# EAGLE design Adafruit eInk Breakout Friend (EAGLE 9.2.0)
COMPANY: ADAFRUIT INDUSTRIES; DRAWN: K. TOWNSEND; REV: A
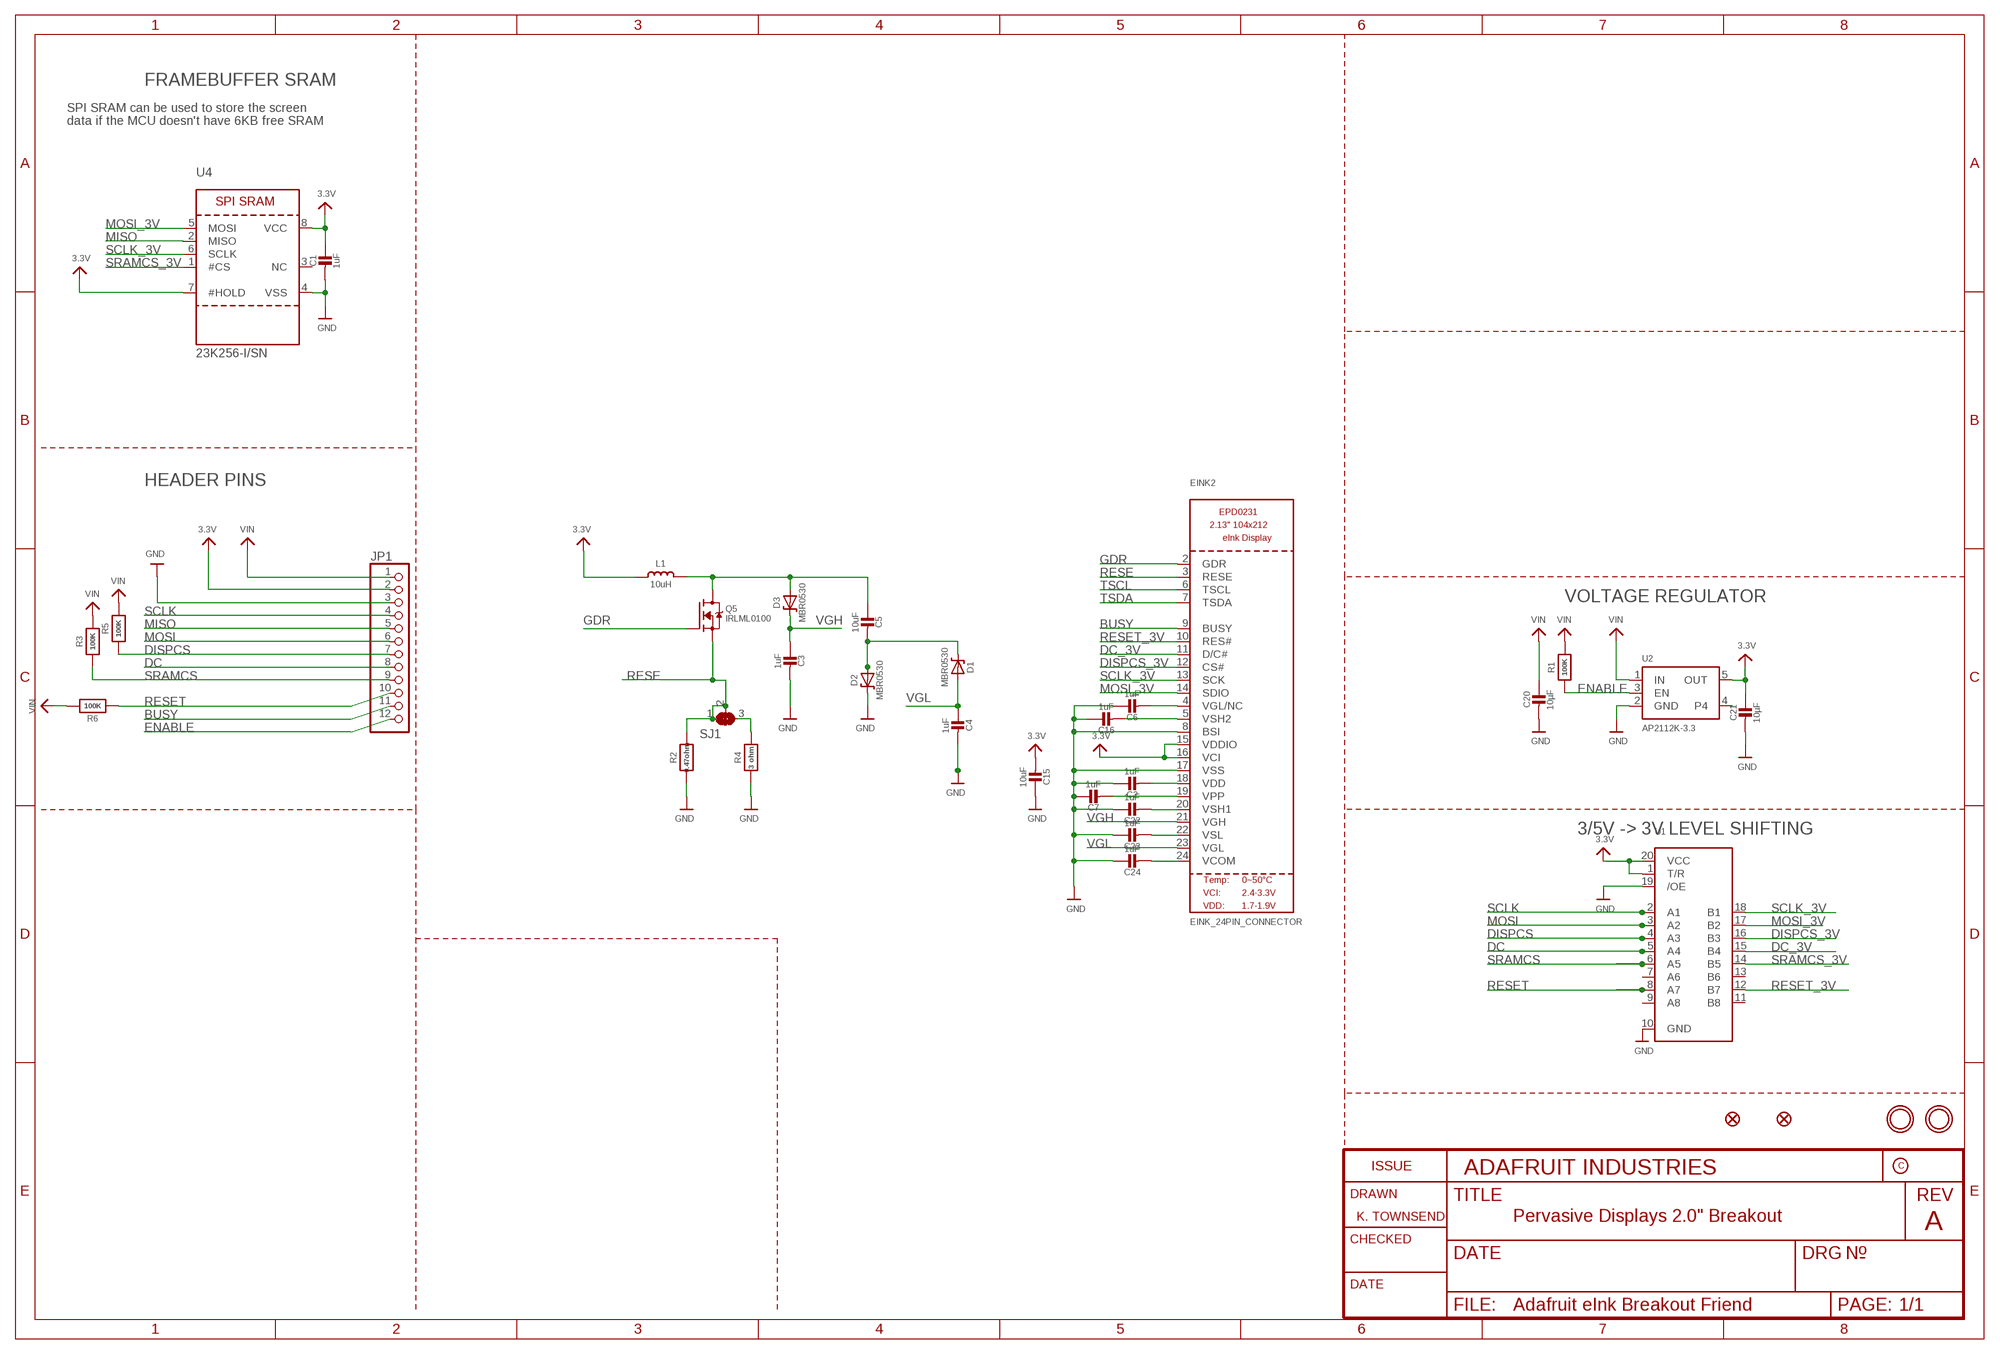
[diagram p0: schematic, sheet 1]

## Parts
C1  1uF  CAP_CERAMIC0805_10MGAP  [0805_10MGAP]
C2  1uF  CAP_CERAMIC0805-NOOUTLINE  [0805-NO]
C3  1uF  CAP_CERAMIC0805-NOOUTLINE  [0805-NO]
C4  1uF  CAP_CERAMIC0805-NOOUTLINE  [0805-NO]
C5  10uF  CAP_CERAMIC0805-NOOUTLINE  [0805-NO]
C6  1uF  CAP_CERAMIC0805-NOOUTLINE  [0805-NO]
C7  1uF  CAP_CERAMIC0805-NOOUTLINE  [0805-NO]
C15  10uF  CAP_CERAMIC0805-NOOUTLINE  [0805-NO]
C16  1uF  CAP_CERAMIC0805-NOOUTLINE  [0805-NO]
C20  10µF  CAP_CERAMIC0805-NOOUTLINE  [0805-NO]
C21  10µF  CAP_CERAMIC0805-NOOUTLINE  [0805-NO]
C22  1uF  CAP_CERAMIC0805-NOOUTLINE  [0805-NO]
C23  1uF  CAP_CERAMIC0805-NOOUTLINE  [0805-NO]
C24  1uF  CAP_CERAMIC0805-NOOUTLINE  [0805-NO]
D1  MBR0530  DIODE-SCHOTTKYSOD-123  [SOD-123]
D2  MBR0530  DIODE-SCHOTTKYSOD-123  [SOD-123]
D3  MBR0530  DIODE-SCHOTTKYSOD-123  [SOD-123]
EINK2  EINK_24PIN_CONNECTOR  [EINK_24PIN]
FID2  FIDUCIAL_1MM  [FIDUCIAL_1MM]
FID3  FIDUCIAL_1MM  [FIDUCIAL_1MM]
JP1  HEADER-1X1276MIL  [1X12_ROUND_76MIL]
L1  10uH  INDUCTORNR401  [INDUCTOR_4X4MM_NR401]
Q5  IRLML0100  IRLML2060TRPBF  [SOT23-3]
R1  100K  RESISTOR_0603_NOOUT  [0603-NO]
R2  0.47ohm  RESISTOR0805_NOOUTLINE  [0805-NO]
R3  100K  RESISTOR_0603_NOOUT  [0603-NO]
R4  3 ohm  RESISTOR0805_NOOUTLINE  [0805-NO]
R5  100K  RESISTOR_0603_NOOUT  [0603-NO]
R6  100K  RESISTOR_0603_NOOUT  [0603-NO]
SJ1  SOLDERJUMPER_2WAY  [SOLDERJUMPER_2WAY_OPEN_NOPASTE]
U1  74LCX245  [TSSOP20]
U2  AP2112K-3.3  VREG_SOT23-5  [SOT23-5]
U4  23K256-I/SN  SRAM_SPI_SOIC8  [SOIC8_150MIL]
U$3  MOUNTINGHOLE2.5  [MOUNTINGHOLE_2.5_PLATED]
U$4  MOUNTINGHOLE2.5  [MOUNTINGHOLE_2.5_PLATED]

## Nets
3.3V: C1.1 C15.2 C21.1 EINK2.15(VDDIO) EINK2.16(VCI) JP1.2 L1.P$2 U1.1(T/R) U1.20(VCC) U2.5(OUT) U4.7(#HOLD) U4.8(VCC)
BUSY: EINK2.9(BUSY) JP1.11
DC: JP1.8 U1.5(A4)
DC_3V: EINK2.11(D/C#) U1.15(B4)
DISPCS: JP1.7 R5.1 U1.4(A3)
DISPCS_3V: EINK2.12(CS#) U1.16(B3)
ENABLE: JP1.12 R1.1 U2.3(EN)
GDR: EINK2.2(GDR) Q5.1(G)
GND: C1.2 C2.1 C3.2 C4.2 C6.1 C7.1 C15.1 C16.1 C20.2 C21.2 C22.1 C23.1 C24.1 D2.C EINK2.8(BSI) EINK2.17(VSS) JP1.3 R2.2 R4.2 U1.10(GND) U1.19(/OE) U2.2(GND) U4.4(VSS)
MISO: JP1.5 U4.2(MISO)
MOSI: JP1.6 U1.3(A2)
MOSI_3V: EINK2.14(SDIO) U1.17(B2) U4.5(MOSI)
N$1: C7.2 EINK2.19(VPP)
N$2: C5.2 D1.C D2.A
N$3: C5.1 D3.A L1.P$1 Q5.3(D)
N$4: C16.2 EINK2.5(VSH2)
N$5: C2.2 EINK2.18(VDD)
N$6: C22.2 EINK2.20(VSH1)
N$8: R4.1 SJ1.3
N$9: C6.2 EINK2.4(VGL/NC)
N$27: C23.2 EINK2.22(VSL)
N$33: C24.2 EINK2.24(VCOM)
RESE: EINK2.3(RESE) Q5.2(S) R2.1 SJ1.1 SJ1.2
RESET: JP1.10 R6.1 U1.8(A7)
RESET_3V: EINK2.10(RES#) U1.12(B7)
SCLK: JP1.4 U1.2(A1)
SCLK_3V: EINK2.13(SCK) U1.18(B1) U4.6(SCLK)
SRAMCS: JP1.9 R3.1 U1.6(A5)
SRAMCS_3V: U1.14(B5) U4.1(#CS)
TSCL: EINK2.6(TSCL)
TSDA: EINK2.7(TSDA)
VGH: C3.1 D3.C EINK2.21(VGH)
VGL: C4.1 D1.A EINK2.23(VGL)
VIN: C20.1 JP1.1 R1.2 R3.2 R5.2 R6.2 U2.1(IN)
Unconnected: U1.7(A6) U1.9(A8) U1.11(B8) U1.13(B6) U2.4 U4.3(NC)

## Notes on the sheet
- FRAMEBUFFER SRAM
- SPI SRAM can be used to store the screen
- data if the MCU doesn't have 6KB free SRAM
- HEADER PINS
- VOLTAGE REGULATOR
- 3/5V -> 3V LEVEL SHIFTING
- Pervasive Displays 2.0" Breakout

## Library data of the parts
C1-C7 C15 C16 C20-C24 = microbuilder:CAP_CERAMIC: Ceramic Capacitors For new designs, use the packages preceded by an '_' character since they are more reliable: The following footprints should be used on most boards: _0402 - Standard footprint for regular board layouts _0603 - Standard footprint for regular board layouts _0805 - Standard footprint for regular board layouts _1206 - Standard footprint for regular board layouts For extremely tight-pitch boards where space is at a premium, the following 'micro-pitch' footprints can be used (smaller pads, no silkscreen outline, etc.): _0402MP - Micro-pitch footprint for very dense/compact boards _0603MP - Micro-pitch footprint for very dense/compact boards _0805MP - Micro-pitch footprint for very dense/compact boards _1206MP - Micro-pitch footprint for very dense/compact boards
D1-D3 = microbuilder:DIODE-SCHOTTKY
EINK2 = microbuilder:EINK_24PIN
FID2 FID3 = microbuilder:FIDUCIAL: Fiducial Alignment Points Various fiducial points for machine vision alignment.; BOM: EXCLUDE
JP1 = microbuilder:HEADER-1X12
L1 = microbuilder:INDUCTOR: Inductors 0603: 10nH Ceramic Inductor - microwire antenna/RF (Digikey: 712-1434-2-ND) 0805: 560nH Ceramic Inductor - RF (Digikey: 553-1047-1-ND) 270nH Ceramic Inductor - Q = 40@250MHz, +-5%, 1 Ohm DC Resistance (Digikey: 535-10506-2-ND) 1007 (2518 Metric) SMT: 10µH 10% 250mOhm 820mA 1007 Inductor (Digikey: 587-2189-1-ND) 22µH 10% 500mOhm 580mA 1007 Inductor (Digikey: 587-2190-1-ND) 47µH 10% 950mOhm 420mA 1007 Inductor (Digikey: 587-2191-1-ND) 47µH 5% 100mOhm 1A 1008 Inductor (Digikey: 732-1816-1-ND) 5.0x5.0mm (Taiyo Yuden NR5040 Series) 6.8µH 20% 2.3A 64mOhm Inductor (Digikey: 587-2374-2-ND) 5.0x5.0mm (TDK VLC5045 Series) 4.7µH 20% 3.3A 34mOhm Inductor (Digikey: 445-6526-1-ND) 6.8µH 20% 2.7A 46mOhm Inductor (Digikey: 445-6527-1-ND) 6.0x6.0mm (TDK VLC6045 Series) 4.7µH 20% 3.8A 27mOhm Inductor (Digikey: 445-6538-2-ND) 6.8µH 20% 3A 41mOhm Inductor (Digikey: 445-6540-1-ND) 6.2µH 30% 2.2A 45mOhm Inductor (Digikey: SRR5028-6R2YCT-ND) - Not TDK VLC6045 but footprint should match 6.0x6.0mm (TDK SLF6045 Series) 6.8uH 30% 2A 33mOhm Inductor (Digikey: 445-4572-1-ND, Mouser: 810-SLF645T6R8N2R0PF) 6.0x6.0mm (Sumida CDRH5D28 Series) 6.2uH 30% 1.8A 45mOhm Inductor (Digikey: 308-1542-1-ND) Taiyo Yuden NR3015T2R2M - 2.2uH 20% 1.5A (Digikey: 587-1648-2-ND, Mouser: 963-NR3015T2R2M) - Used with TI TPS62172 CoilCraft RFID Transponder Coil - MA5532-AE (For use with AS3935 Lightning Sensor) Taiyo Yuden NRH2412T2R2MNGH - 2.2uH 20% 1AA (Digikey: 587-3443-1-ND) - Used with TI LM3671 Vishay IHLP 1.0uH Molded Inductor - 24mOhm DCR, 5A, +/-20%, -55°C-125°C (Digikey: 541-1319-1-ND)
Q5 = Parts:IRLML2060TRPBF
R1-R6 = microbuilder:RESISTOR: Resistors For new designs, use the packages preceded by an '_' character since they are more reliable: The following footprints should be used on most boards: _0402 - Standard footprint for regular board layouts _0603 - Standard footprint for regular board layouts _0805 - Standard footprint for regular board layouts _1206 - Standard footprint for regular board layouts For extremely tight-pitch boards where space is at a premium, the following 'micro-pitch' footprints can be used (smaller pads, no silkscreen outline, etc.): _0402MP - Micro-pitch footprint for very dense/compact boards _0603MP - Micro-pitch footprint for very dense/compact boards _0805MP - Micro-pitch footprint for very dense/compact boards _1206MP - Micro-pitch footprint for very dense/compact boards
SJ1 = microbuilder:SOLDERJUMPER_2WAY: 2-Way Solder Jumper
U1 = microbuilder:74LCX245: 74LCX245MTC - 5.0V Tolerant Bi-Directional Buffer Can be used to interface 5.0V logic to 2.5 or 3.3V devices Digikey: 74LCX245MTCXTR-ND Mouser: 512-74LCX245MTCX
U2 = microbuilder:VREG_SOT23-5: SOT23-5 Fixed Voltage Regulators Part Current Out V Out V In V Dropout θJA (°C/W) TJ (°C) Digikey Part No. ADP121 150mA 3.3V 3.4-5.5V 0.09V @ 150mA -- -- ADP121-AUJZ33R7CT-ND ADP121 150mA 3.0V 3.1-5.5V 0.09V @ 150mA -- -- ADP121-AUJZ30R7CT-ND ADP122 300mA 3.3V 3.4-5.5V 0.085V @ 300mA -- -- ADP122AUJZ-3.3-R7CT-ND ADP1712 300mA 3.3V 3.5-5.5V 0.17V @ 300mA -- -- ADP1712AUJZ-3.3-R7TR-ND AP7311 (Low Cost) 150mA 3.3V 3.5-6V 0.15V @ 150mA -- -- AP7311-33WG-7DICT-ND LD39015M18R 150mA 1.8V 1.9V-5.5V 0.08V @ 100mA -- -- 497-6977-1-ND LP2985A-33DBVR 150mA 3.3V 3.3-16V 0.28V @ 150mA 206 150 296-18479-1-ND MCP1824T-3302E/OT 300mA 3.3V 3.5V-6V 0.2V @ 300mA -- -- MCP1824T-3302E/OTCT-ND MIC5205-2.5YM5 TR 150mA 2.5V 2.7-16V 0.165V @ 150mA -- -- 576-1257-2-ND MIC5205-3.0YM5 TR 150mA 3.0V 3.2V-16V 0.165V @ 150mA -- -- 576-1258-2-ND MIC5205-3.3YM5 TR 150mA 3.3V 3.5V-16V 0.165V @ 150mA -- -- 576-1259-2-ND TPS780330220 150mA 3.3V+2.2V 3.6-5.5V 250mV Max -- -- 296-23332-1-ND TDA3663/N1,135 100mA 3.3V 3.5-45V 0.18V @ 50mA -- -- 568-5343-1-ND Max operating temp can be calculated using θJA, TJ (max junction temperature), and power in watts. Set the "Maximum Ambient Temperature" until it reaches TJ ("Max Junction Temperature"), which is the absolute limit for safe use of the regulator: Heat Sink Temperature Calculator <http://www.daycounter.com/Calculators/Heat-Sink-Temperature-Calculator.phtml> For example, With 12V source into a 3.3V LP2985 and a 30mA load, we are dissipating (12V-3.3V) * 0.03A = 0.261W. With a θJA of 206 °C/W, a TJ of 150°C, and 261mW we can safely use the chip without a heat sink up to 75°C (=147.1°C Junction Temperature).
U4 = microbuilder:SRAM_SPI_SOIC8: SRAM - 8-Pin SPI Interface 23K640-I/SN - 8KB (64Kb), 20MHz, 2.7-3.6V 23K256-I/SN - 32KB (256Kb), 20MHz, 2.7-3.6V 23LC512-I/SN - 64KB (512Kb), 20MHz, 2.7-3.6V
U$3 U$4 = microbuilder:MOUNTINGHOLE: Mounting Hole For #2 screws (0.086"/2.18mm width, 0.094"/2.4mm hole) use 2.5mm; BOM: EXCLUDE

## Board
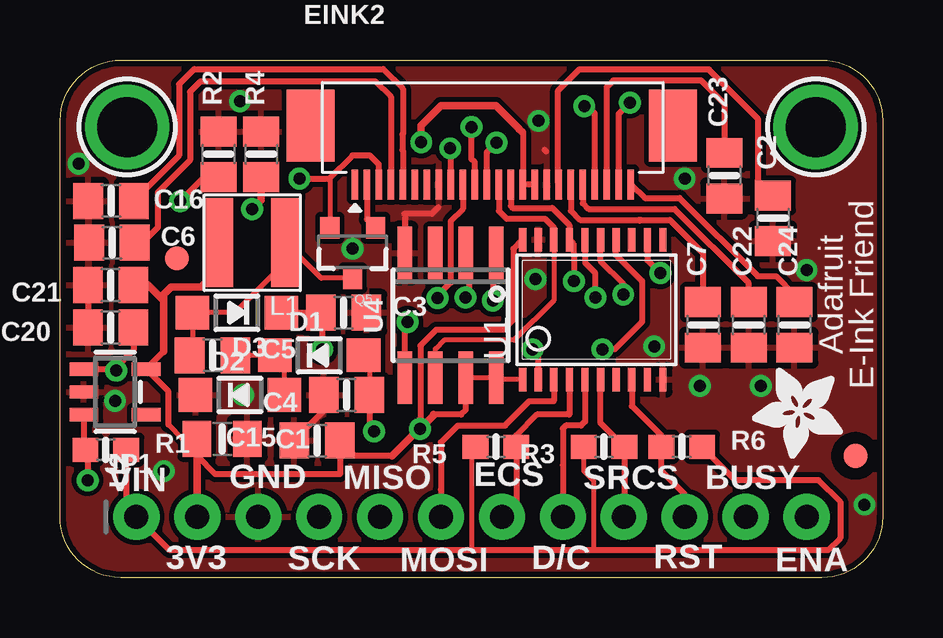
[diagram p1: board, top side]
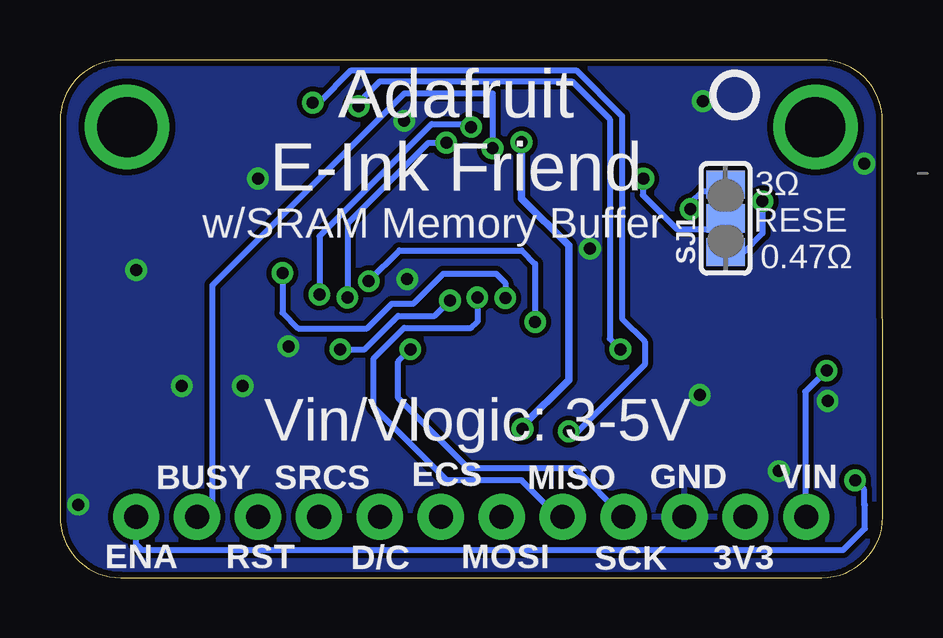
[diagram p2: board, bottom side, seen from below]

Size 34.3 x 21.59 mm. Coordinates in mm from the lower left corner, seen from the top.
Outline: 2.55,21.59 31.76,21.59 arc-90 34.3,19.05 34.3,2.54 arc-90 31.76,0 2.54,0 arc-90 0,2.53 0.01,19.06 arc-90 2.55,21.59
Copper layers (1*16): Top 0.035mm / dielectric 1.5mm / Bottom 0.035mm
Design rules "adafruit *": minimum track width 8mil, minimum drill 15.5mil, track to track 8mil, track to pad 8mil, pad to pad 8mil, via to via 8mil, smd to smd 8mil, copper to edge 10mil, drill to drill 8mil, minimum pad ring 10mil, minimum via ring 8mil, stop-mask expansion 2mil, vias tented up to drill 20mil, thermal gap 10mil

### Footprints (pad centres in the part's own frame; a part is rotated, then mirrored left to right if it is on the bottom)
0805_10MGAP = smd 1.2 x 1.5: 1 -1.05,0; 2 1.05,0
0805-NO = smd 1.24 x 1.5: 1 -0.95,0; 2 0.95,0
SOD-123 = smd 1.4 x 1.4: A 1.85,0; C -1.85,0
EINK_24PIN = smd 0.275 x 1.25: 1 -5.75,-2.25; 2 -5.25,-2.25; 3 -4.75,-2.25; 4 -4.25,-2.25; 5 -3.75,-2.25; 6 -3.25,-2.25; 7 -2.75,-2.25; 8 -2.25,-2.25; 9 -1.75,-2.25; 10 -1.25,-2.25; 11 -0.75,-2.25; 12 -0.25,-2.25; 13 0.25,-2.25; 14 0.75,-2.25; 15 1.25,-2.25; 16 1.75,-2.25; 17 2.25,-2.25; 18 2.75,-2.25; 19 3.25,-2.25; 20 3.75,-2.25; 21 4.25,-2.25; 22 4.75,-2.25; 23 5.25,-2.25; 24 5.75,-2.25 | smd 2 x 3: SPRT1 -7.6,0.21; SPRT2 7.51,0.21
FIDUCIAL_1MM = smd 1 x 1: 1 0,0
1X12_ROUND_76MIL = drill 1 pad 1.93: 1 -13.97,0; 2 -11.43,0; 3 -8.89,0; 4 -6.35,0; 5 -3.81,0; 6 -1.27,0; 7 1.27,0; 8 3.81,0; 9 6.35,0; 10 8.89,0; 11 11.43,0; 12 13.97,0
INDUCTOR_4X4MM_NR401 = smd 1.2 x 3.7: P$1 -1.4,0; P$2 1.4,0
SOT23-3 = smd 0.8 x 0.9: 1 -0.95,-1; 2 0.95,-1; 3 0,1.1
0603-NO = smd 1.075 x 1: 1 -0.85,0; 2 0.85,0
SOLDERJUMPER_2WAY_OPEN_NOPASTE = smd 1.168 x 1.6: 1 -1.397,0; 2 0,0; 3 1.397,0
TSSOP20 = smd 0.305 x 0.991: 1 -3.075,-2.918; 2 -2.425,-2.918; 3 -1.775,-2.918; 4 -1.125,-2.918; 5 -0.475,-2.918; 6 0.175,-2.918; 7 0.825,-2.918; 8 1.475,-2.918; 9 2.125,-2.918; 10 2.775,-2.918; 11 2.775,2.918; 12 2.125,2.918; 13 1.475,2.918; 14 0.825,2.918; 15 0.175,2.918; 16 -0.475,2.918; 17 -1.125,2.918; 18 -1.775,2.918; 19 -2.425,2.918; 20 -3.075,2.918
SOT23-5 = smd 0.55 x 1.2: 1 -0.95,-1.3; 2 0,-1.3; 3 0.95,-1.3; 4 0.95,1.3; 5 -0.95,1.3
SOIC8_150MIL = smd 0.6 x 2.2: 1 -1.905,-2.6; 2 -0.635,-2.6; 3 0.635,-2.6; 4 1.905,-2.6; 5 1.905,2.6; 6 0.635,2.6; 7 -0.635,2.6; 8 -1.905,2.6
MOUNTINGHOLE_2.5_PLATED = drill 2.5 pad 3.2: P$1 0,0

### Placement (x,y rotation side)
C1  6.76,5.79 0 top
C2  29.73,14.99 90 top
C3  11.82,11.05 0 top
C4  11.95,7.62 180 top
C5  6.36,9.27 0 top
C6  2.17,13.97 0 top
C7  26.81,10.54 90 top
C15  10.72,5.72 0 top
C16  2.13,15.71 0 top
C20  2.12,10.43 180 top
C21  2.12,12.2 180 top
C22  28.71,10.54 90 top
C23  27.7,16.76 90 top
C24  30.62,10.54 90 top
D1  10.81,9.27 0 top
D2  7.5,7.62 0 top
D3  7.38,11.05 180 top
EINK2  18.04,18.64 0 top
FID2  4.88,13.32 180 top
FID3  33.16,5.08 0 top
JP1  17.16,2.54 0 top
L1  8.01,13.97 180 top
Q5  12.2,13.59 180 top
R1  1.92,5.33 0 top
R2  6.61,17.65 90 top
R3  22.68,5.46 180 top
R4  8.39,17.65 90 top
R5  18.17,5.46 180 top
R6  25.92,5.46 0 top
SJ1  6.55,14.99 90 bottom
U1  22.36,11.18 0 top
U2  2.3,7.75 270 top
U4  16.29,10.94 180 top
U$2  [ADAFRUIT_3.5MM]  32.65,8.76 180 top
U$3  31.51,18.8 0 top
U$4  2.8,18.8 0 top
U$9  [PCBFEAT-REV-040]  6.17,20.13 0 bottom

### Tracks (layer width: path | path; a pad name or v marks a point on that pad's centre or on a via)
3.3V  (via drill 0.5)
  Top 0.203: U4.7 U4.8 18.28,8.26 U1.1 | C1.1 5.12,5.79 4.53,6.38
  Top 0.254: 4.53,6.38 4.53,7.77 U2.5 4.33,9.43 | 13.85,5.08 12.3,5.08 C15.2 11.67,4.32 6.49,4.32 5.71,5.09 C1.1 | 15.57,6.81 16.72,6.81 16.92,7.01 U4.7 | 15.02,6.6 15.02,9.68 15.68,10.34 18.48,10.34 18.91,10.77 18.91,13.71 U1.20 | 19.28,18.58 19.29,18.56 EINK2.15 EINK2.16
  Top 0.305: 19.28,18.58 19.14,18.71 19.14,18.72 18.17,19.68 15.89,19.68 15.06,18.86 v15.06,18.16 | 13.85,5.08 14.97,6.21 v15.01,6.21 | 15.02,6.6 15.01,6.59 v15.01,6.21 | 15.57,6.81 15.57,6.76 v15.01,6.21 | 4.33,9.43 4.33,11.56 | JP1.2 5.73,5.78 C1.1 | 4.33,11.56 3.68,12.2 C21.1 | 4.33,11.56 4.33,11.81 4.65,12.13 5.88,12.13 6.61,12.86 L1.P$2
  Bottom 0.305: v15.06,18.16 15.06,15.81 13.09,13.84 13.09,8.26 15.01,6.33 v15.01,6.21
BUSY  (via drill 0.5)
  Top 0.254: EINK2.9 16.29,17.88 v16.27,17.91
  Bottom 0.254: v16.27,17.91 16.27,20.19 19.95,20.19 27.95,12.19 27.95,3.17 JP1.11
DC
  Top 0.254: U1.5 21.89,6.51 21.73,6.35 21.09,6.35 20.96,6.22 20.96,4.7 20.97,4.69 JP1.8
DC_3V  (via drill 0.5)
  Top 0.254: U1.15 22.54,13.21 23.48,12.26 v23.48,11.81 | EINK2.11 17.29,17.32 17.16,17.46 v17.16,18.8
  Bottom 0.254: v23.48,11.81 23.48,14.24 18.81,18.92 17.28,18.92 v17.16,18.8
DISPCS
  Top 0.254: U1.4 21.24,6.81 19.89,6.81 19.02,5.94 R5.1 19.02,3.14 JP1.7
DISPCS_3V  (via drill 0.5)
  Top 0.254: U1.16 21.89,13.13 22.32,12.7 v22.32,11.68 | EINK2.12 17.79,17.74 v18.19,18.14
  Bottom 0.254: v22.32,11.68 22.32,14.76 18.94,18.14 v18.19,18.14
ENABLE  (via drill 0.5)
  Top 0.254: U2.3 1,5.4 R1.1 1.15,5.25 v1.15,4.06
  Bottom 0.254: v1.15,4.06 0.77,3.68 0.77,3.05 0.75,3.02 0.75,2.06 1.66,1.14 30.87,1.14 31.13,1.4 JP1.12
GDR
  Top 0.254: EINK2.2 12.79,14.95 Q5.1
GND  (via drill 0.5)
  Top 0.254: C21.2 C20.2 | C4.2 11,6.95 C15.1 | U4.4 14.38,15.15 14.36,15.18 15.5,15.18 15.77,15.44 | 20.27,17.78 20.2,17.84
  other vias: 26.05,16.64 31.13,12.83 26.68,8 24.78,9.65 7.63,7.62 2.3,7.37 0.77,17.27 12.2,13.72 19.95,19.05 19.82,12.45 29.22,8 4.33,4.45 33.54,3.05 7.5,19.88
  pour Bottom: 0.01,21.59 34.3,21.59 34.3,0 0.01,0
  pour Top: 0.01,21.59 34.3,21.59 34.3,0 0.01,0
MISO  (via drill 0.5)
  Top 0.254: v16.9,11.68 17.03,11.81 17.05,11.81 17.05,13.41 U4.2
  Bottom 0.254: v16.9,11.68 16.9,10.67 17.16,10.41 19.95,10.41 21.22,9.14 21.22,7.11 18.17,4.06 15.06,4.06 13.54,2.54 JP1.5
MOSI
  Top 0.254: U1.3 20.59,7.37 19.57,7.37 18.55,6.35 16.58,6.35 15.89,5.65 15.89,3.68 15.89,3.37 JP1.6
MOSI_3V  (via drill 0.5)
  Top 0.254: U4.5 14.38,10.67 v14.49,10.67 | v21.43,12.36 21.43,13.44 21.4,13.46 21.4,13.93 U1.17 21.24,14.71 20.53,15.42 18.88,15.42 18.79,15.5 EINK2.14
  Bottom 0.254: v14.49,10.67 14.49,13.08 15.05,13.64 20.15,13.64 v21.43,12.36
N$1
  Top 0.254: C7.2 26.81,13.54 25.43,14.92 24.2,14.92 24.16,14.88 24.13,14.92 21.68,14.92 21.29,15.3 EINK2.19
N$2
  Top 0.203: C5.2 D1.C 9.35,8.87 D2.A
N$3
  Top 0.203: C5.1 5.53,9.39 D3.A 7.3,11.05 9.41,13.16 L1.P$1 10.89,12.49 Q5.3
N$4
  Top 0.254: C16.2 4.96,17.59 4.96,20.57 5.6,21.21 13.47,21.21 14.29,20.39 14.29,18.5 14.28,18.48 14.28,17.84 14.29,17.82 EINK2.5
N$5
  Top 0.254: C2.2 29.09,16.57 29.09,19.15 27.05,21.19 21.64,21.19 20.77,20.32 20.77,16.45 EINK2.18
N$6
  Top 0.254: C22.2 28.71,12.28 25.62,15.38 22.04,15.38 21.79,15.62 EINK2.20
N$8  (via drill 0.5)
  Top 0.305: R4.1 8.39,15.75 v8.01,15.37
  Bottom 0.254: v8.01,15.37 8.01,15.62 7.5,16.13 6.81,16.13 SJ1.3
N$9
  Top 0.254: C6.2 3.44,13.97 4.07,14.61 4.07,16.06 5.42,17.41 5.42,20.26 5.86,20.7 13.14,20.7 13.79,20.05 EINK2.4
N$27
  Top 0.254: C23.2 27.7,19.77 26.74,20.73 23.07,20.73 22.79,20.46 EINK2.22
N$33
  Top 0.254: C24.2 30.62,11.81 29.86,12.57 29.09,12.57 25.83,15.83 24.38,15.83 EINK2.24
RESE  (via drill 0.5)
  Top 0.203: 11.25,16.61 Q5.2
  Top 0.254: 10.04,16.7 v9.98,16.64 11.22,16.64 | R2.1 6.02,16.7 v5.01,15.7 | EINK2.3 13.29,17.23 12.92,17.61 12.19,17.61 11.22,16.64 | 11.22,16.64 11.25,16.61
  Bottom 0.254: 7,14.54 SJ1.2 6.55,14.67 | v9.98,16.64 10,16.62 10,15.96 8.58,14.54 6.68,14.54 6.55,14.67 | v5.01,15.7 5.01,14.37 5.79,13.59 SJ1.1 6.55,14.67
RESET
  Top 0.254: U1.8 23.84,7.16 25.07,5.93 R6.1 25.07,4.45 26.05,3.47 JP1.10
RESET_3V  (via drill 0.5)
  Top 0.254: U1.12 24.49,13.24 v25.03,12.7 | v15.74,11.66 15.74,11.76 16.28,12.3 16.28,14.87 16.79,15.38 EINK2.10
  Bottom 0.254: v15.74,11.66 15.74,12.3 16.12,12.68 18.32,12.68 19.57,11.43 20.46,11.43 21.49,10.39 24.37,10.39 25.03,11.05 v25.03,12.7
SCLK  (via drill 0.5)
  Top 0.254: v19.7,9.53 19.94,9.53 U1.2
  Bottom 0.254: v19.7,9.53 20.2,9.02 20.2,7.49 17.28,4.57 12.84,4.57 JP1.4
SCLK_3V
  Top 0.203: U4.6 15.65,9.55 16.01,9.91 18.93,9.91 20.59,11.56 U1.18
  Top 0.254: 18.62,14.97 18.64,14.97 | U1.18 20.59,14.6 20.22,14.97 18.74,14.97 18.64,14.97 | EINK2.13 18.29,15.29 18.62,14.97 18.63,14.97 18.64,14.97
SRAMCS
  Top 0.254: U1.6 22.51,8.23 22.51,6.48 R3.1 23.53,2.56 JP1.9
SRAMCS_3V  (via drill 0.5)
  Top 0.254: U4.1 18.04,13.39 v18.04,11.56 | v22.62,9.53 23.12,9.53 24.27,10.67 24.27,12.38 23.19,13.46 U1.14
  Bottom 0.254: v18.04,11.56 18.68,10.92 20.2,10.92 21.6,9.53 v22.62,9.53
VGH  (via drill 0.5)
  Top 0.203: C3.1 D3.C
  Top 0.254: v21.85,19.66 21.98,19.66 22.29,19.35 EINK2.21 | C3.1 10.93,10.99 v10.93,9.53
  Bottom 0.254: v21.85,19.66 21.85,19.81 20.97,20.7 12.96,20.7 11.38,19.11 11.38,9.97 v10.93,9.53
VGL  (via drill 0.5)
  Top 0.203: C4.1 12.9,9.03 D1.A
  Top 0.254: C4.1 12.9,6.29 v13.09,6.1 | EINK2.23 23.29,19.35 v23.76,19.81
  Bottom 0.254: v23.76,19.81 23.51,19.81 22.16,21.16 12.78,21.16 10.87,19.25 10.87,10.79 9.92,9.84 9.92,8.89 12.71,6.1 v13.09,6.1
VIN  (via drill 0.5)
  Top 0.203: 17.16,5.29 17.16,1.14 | R3.2 21.83,4.47 22.24,4.06 22.24,1.14
  Top 0.254: R5.2 17.16,5.29 | U2.1 2.28,8.7 | 2.28,8.7 v2.34,8.64 | C20.1 3.07,9.48 2.88,9.3 2.86,9.3 2.67,9.11 2.67,9.08 2.28,8.7 | R1.2 2.77,2.96 JP1.1 4.58,1.14 17.16,1.14 22.24,1.14 32.01,1.14 32.52,1.65 32.52,3.17 31.63,4.06 28.17,4.06 R6.2
  Bottom 0.254: v2.34,8.64 3.23,7.75 3.23,2.58 JP1.1

### Text on the board
tPlace: Adafruit | E-Ink Friend | VIN | GND | MISO | ECS | SRCS | BUSY | 3V3 | SCK | MOSI | D/C | RST | ENA
bPlace: Adafruit / E-Ink Friend | 3Ω | RESE | w/SRAM Memory Buffer | 0.47Ω | Vin/Vlogic: 3-5V | VIN | GND | MISO | ECS | SRCS | BUSY | 3V3 | SCK | MOSI | D/C | RST | ENA